# EAGLE design board (EAGLE 6.5.0)
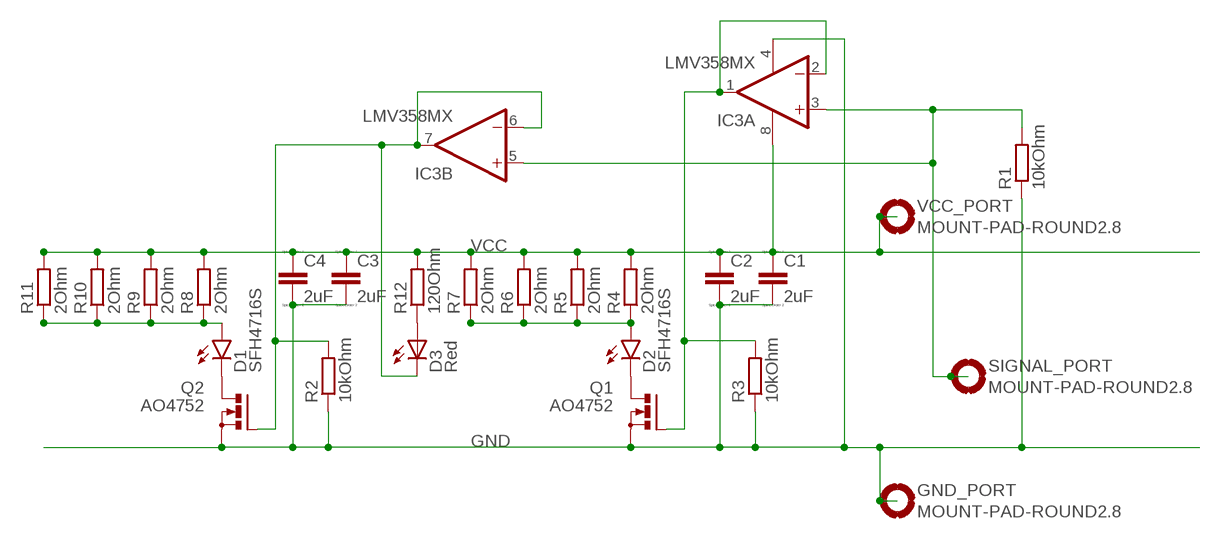
[diagram p0: schematic, sheet 1]

## Parts
C1  2uF  CC0603  [C0603]
C2  2uF  CC0603  [C0603]
C3  2uF  CC0603  [C0603]
C4  2uF  CC0603  [C0603]
D1  SFH4716S  SFH4641LARGE  [SFH4641]
D2  SFH4716S  SFH4641LARGE  [SFH4641]
D3  Red  LED5MM  [LED5MM]
GND_PORT  MOUNT-PAD-ROUND2.8  [2,8-PAD]
IC3  LMV358MX  [SO08]
Q1  AO4752  N-MOSFET-SO8S  [SO-08]
Q2  AO4752  N-MOSFET-SO8S  [SO-08]
R1  10kOhm  R-EU_R0603  [R0603]
R2  10kOhm  R-EU_R0603  [R0603]
R3  10kOhm  R-EU_R0603  [R0603]
R4  2Ohm  R-EU_R2512  [R2512]
R5  2Ohm  R-EU_R2512  [R2512]
R6  2Ohm  R-EU_R2512  [R2512]
R7  2Ohm  R-EU_R2512  [R2512]
R8  2Ohm  R-EU_R2512  [R2512]
R9  2Ohm  R-EU_R2512  [R2512]
R10  2Ohm  R-EU_R2512  [R2512]
R11  2Ohm  R-EU_R2512  [R2512]
R12  120Ohm  R-EU_R0603  [R0603]
SIGNAL_PORT  MOUNT-PAD-ROUND2.8  [2,8-PAD]
VCC_PORT  MOUNT-PAD-ROUND2.8  [2,8-PAD]

## Nets
F1: D2.C Q1.5(D) Q1.6(D) Q1.7(D) Q1.8(D)
F2: D1.C Q2.5(D) Q2.6(D) Q2.7(D) Q2.8(D)
GND: C1.2 C2.2 C3.2 C4.2 GND_PORT.B2,8(MOUNT) IC3.4(P:V-) Q1.1(S) Q1.2(S) Q1.3(S) Q2.1(S) Q2.2(S) Q2.3(S) R1.1 R2.1 R3.1
L1: D1.A R8.1 R9.1 R10.1 R11.1
L2: D2.A R4.1 R5.1 R6.1 R7.1
N$1: D3.A R12.1
N$4: D3.K(C) IC3.6(B:-IN) IC3.7(B:OUT) Q2.4(G) R2.2
N$5: IC3.3(A:+IN) IC3.5(B:+IN) R1.2 SIGNAL_PORT.B2,8(MOUNT)
N$8: IC3.1(A:OUT) IC3.2(A:-IN) Q1.4(G) R3.2
VCC: C1.1 C2.1 C3.1 C4.1 IC3.8(P:V+) R4.2 R5.2 R6.2 R7.2 R8.2 R9.2 R10.2 R11.2 R12.2 VCC_PORT.B2,8(MOUNT)

## Library data of the parts
C1-C4 = eagle-ltspice:C: CAPACITOR, European symbol; SPICEMODEL: NONE; SPICEPREFIX: C
D1 D2 = SparkFun-LED:SFH4641; PROD_ID: DIO-11994
D3 = led:LED: LED OSRAM: - CHIPLED LG R971, LG N971, LY N971, LG Q971, LY Q971, LO R971, LY R971 LH N974, LH R974 LS Q976, LO Q976, LY Q976 LO Q996 - Hyper CHIPLED LW Q18S LB Q993, LB Q99A, LB R99A - SideLED LS A670, LO A670, LY A670, LG A670, LP A670 LB A673, LV A673, LT A673, LW A673 LH A674 LY A675 LS A676, LA A676, LO A676, LY A676, LW A676 LS A679, LY A679, LG A679 - Hyper Micro SIDELED® LS Y876, LA Y876, LO Y876, LY Y876 LT Y87S - SmartLED LW L88C, LW L88S LB L89C, LB L89S, LG L890 LS L89K, LO L89K, LY L89K LS L896, LA L896, LO L896, LY L896 - TOPLED LS T670, LO T670, LY T670, LG T670, LP T670 LSG T670, LSP T670, LSY T670, LOP T670, LYG T670 LG T671, LOG T671, LSG T671 LB T673, LV T673, LT T673, LW T673 LH T674 LS T676, LA T676, LO T676, LY T676, LB T676, LH T676, LSB T676, LW T676 LB T67C, LV T67C, LT T67C, LS T67K, LO T67K, LY T67K, LW E67C LS E67B, LA E67B, LO E67B, LY E67B, LB E67C, LV E67C, LT E67C LW T67C LS T679, LY T679, LG T679 LS T770, LO T770, LY T770, LG T770, LP T770 LB T773, LV T773, LT T773, LW T773 LH T774 LS E675, LA E675, LY E675, LS T675 LS T776, LA T776, LO T776, LY T776, LB T776 LHGB T686 LT T68C, LB T68C - Hyper Mini TOPLED® LB M676 - Mini TOPLED Santana® LG M470 LS M47K, LO M47K, LY M47K Source: http://www.osram.convergy.de LUXEON: - LUMILED® LXK2-PW12-R00, LXK2-PW12-S00, LXK2-PW14-U00, LXK2-PW14-V00 LXK2-PM12-R00, LXK2-PM12-S00, LXK2-PM14-U00 LXK2-PE12-Q00, LXK2-PE12-R00, LXK2-PE12-S00, LXK2-PE14-T00, LXK2-PE14-U00 LXK2-PB12-K00, LXK2-PB12-L00, LXK2-PB12-M00, LXK2-PB14-N00, LXK2-PB14-P00, LXK2-PB14-Q00 LXK2-PR12-L00, LXK2-PR12-M00, LXK2-PR14-Q00, LXK2-PR14-R00 LXK2-PD12-Q00, LXK2-PD12-R00, LXK2-PD12-S00 LXK2-PH12-R00, LXK2-PH12-S00 LXK2-PL12-P00, LXK2-PL12-Q00, LXK2-PL12-R00 Source: www.luxeon.com KINGBRIGHT: KA-3528ASYC Source: www.kingbright.com
GND_PORT SIGNAL_PORT VCC_PORT = holes:MOUNT-PAD-ROUND: MOUNTING PAD, round
IC3 = linear:LMV358?*: Dual General Purpose, Low Voltage, Rail-to-Rail Output Operational Amplifiers Source: http://www.national.com/mpf/LM/LMV321.html http://www.national.com/dt/lmv_qual.pdf
Q1 Q2 = transistor-power:N-MOSFET-SO8: N-Channel MOSFET Example: FDS7760A; N-Channel Logic Level PowerTrench® MOSFET FDS2572; N-Channel UltraFET® Trench MOSFET Source: www.fairchildsemi.com
R1-R3 R12 = resistor:R-EU_: RESISTOR, European symbol
R4-R11 = rcl:R-EU_: RESISTOR, European symbol

## Net classes
0 default: clearance 0.205 mm

## Board
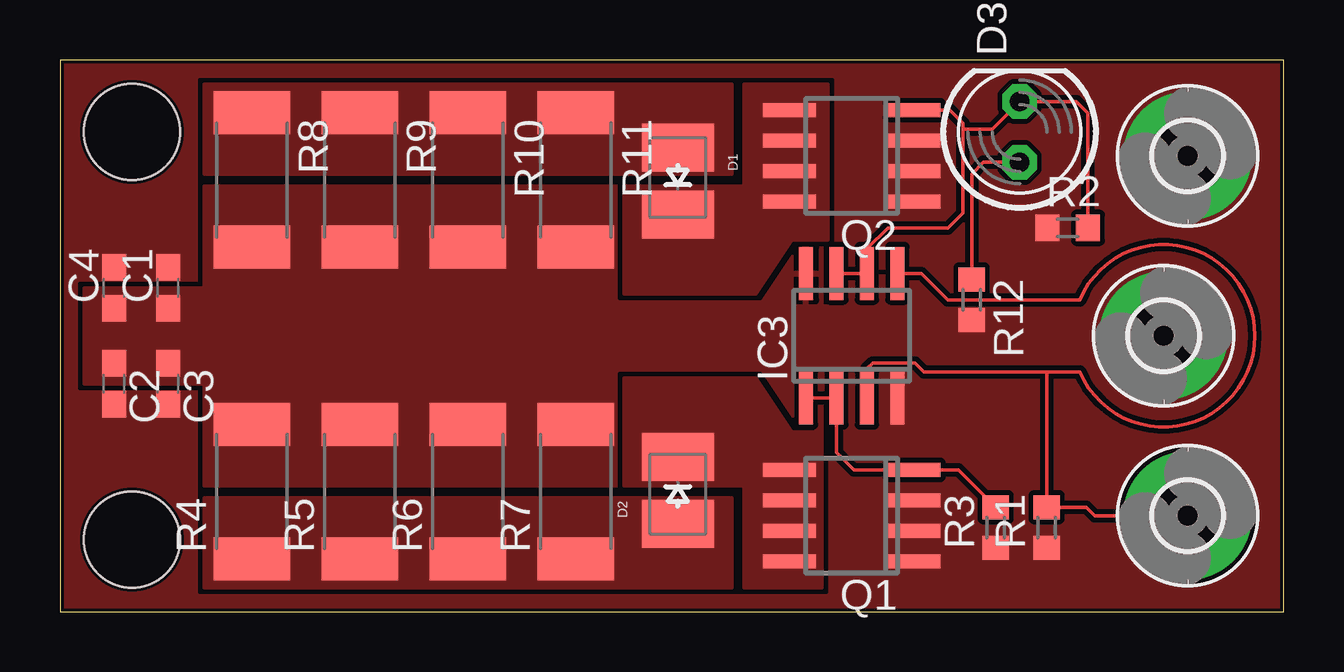
[diagram p1: board, top side]

Size 51 x 23 mm. Coordinates in mm from the lower left corner, seen from the top.
Outline: 0,0 51,0 51,23 0,23 0,0
Copper layers 1: Top 0.035mm
Design rules "SparkFun *": minimum track width 0.15mm, minimum drill 20mil, track to track 0.15mm, track to pad 0.15mm, pad to pad 0.15mm, via to via 0.15mm, smd to smd 0.15mm, copper to edge 0.15mm, drill to drill 0.15mm, minimum pad ring 12mil, minimum via ring 10mil, stop-mask expansion 4mil, vias tented up to drill 20mil, thermal gap 10mil
Holes 4 mm at 3,20 3,3

### Footprints (pad centres in the part's own frame; a part is rotated, then mirrored left to right if it is on the bottom)
C0603 = smd 1.1 x 1: 1 -0.85,0; 2 0.85,0
SFH4641 = smd 3 x 2: A 0,-1.6; C 0,1.2
LED5MM = drill 0.813 octagon: A -1.27,0; K 1.27,0
2,8-PAD = drill 2.8 pad 5.334: B2,8 0,0
SO08 = smd 0.6 x 2.2: 1 -1.905,-2.6; 2 -0.635,-2.6; 3 0.635,-2.6; 4 1.905,-2.6; 5 1.905,2.6; 6 0.635,2.6; 7 -0.635,2.6; 8 -1.905,2.6
SO-08 = smd 0.6 x 2.2: 1 -1.905,-2.6; 2 -0.635,-2.6; 3 0.635,-2.6; 4 1.905,-2.6; 5 1.905,2.6; 6 0.635,2.6; 7 -0.635,2.6; 8 -1.905,2.6
R0603 = smd 1 x 1.1: 1 -0.85,0; 2 0.85,0
R2512 = smd 1.8 x 3.2: 1 -2.8,0; 2 2.8,0

### Placement (x,y rotation side)
C1  4.5,13.5 90 top
C2  2.25,9.5 270 top
C3  4.5,9.5 270 top
C4  2.25,13.5 90 top
D1  25.75,17.75 180 top
D2  25.75,5.25 0 top
D3  40,20 90 top
GND_PORT  47,19 0 top
IC3  33,11.5 0 top
Q1  33,4 90 top
Q2  33,19 90 top
R1  41.12,3.5 90 top
R2  42,16 0 top
R3  39,3.5 90 top
R4  8,5 90 top
R5  12.5,5 90 top
R6  17,5 90 top
R7  21.5,5 90 top
R8  8,18 270 top
R9  12.5,18 270 top
R10  17,18 270 top
R11  21.5,18 270 top
R12  38,13 270 top
SIGNAL_PORT  47,4 0 top
VCC_PORT  46,11.5 0 top

### Tracks (layer width: path | path; a pad name or v marks a point on that pad's centre or on a via)
F1
  pour Top (no thermals): 23.5,5.25 28.5,5.25 28.5,1 31.75,1 31.75,8.62 31.5,8.62 31.5,7.5 30.5,7.5 29,9.75 23.5,9.75
F2
  pour Top (no thermals): 23.5,17.75 28.5,17.75 28.5,22 32,22 32,15.5 30.5,15.5 29,13.25 23.5,13.25
GND
  pour Top (isolate 0.15, rank 3, no thermals): 0,23 51,23 51,0 0,0
  pour Top (no thermals): 33.75,5.25 37.5,5.25 37.5,1 33.75,1
  pour Top (no thermals): 37,20.25 37,16.75 36.75,16.5 34.25,16.5 33.75,17 33.75,20 34,20.25
L1
  pour Top (no thermals): 6,18.25 28,18.25 28,22 6,22
L2
  pour Top (no thermals): 28,4.75 28,1 6,1 6,4.75
N$1
  Top 0.15: D3.A 38.48,18.73 38,18.25 R12.1
N$4
  Top 0.15: IC3.7 IC3.6 33.63,15.13 34.5,16 37,16 37.62,16.62 37.62,20.12 | 37.62,20.12 37.62,20.38 37.09,20.91 Q2.4 | R2.2 42.85,20.77 42.35,21.27 D3.K 38.85,20.12 37.62,20.12
N$5
  Top 0.15: IC3.5 35.9,14.1 37,13 42.5,13 arc-314 42.5,10 41.12,10 | 41.12,10 36,10 35.62,10.38 33.88,10.38 33.63,10.13 IC3.3 | SIGNAL_PORT.B2,8 43.12,4 42.77,4.35 R1.2 41.12,10
N$8
  Top 0.15: IC3.1 IC3.2 32.37,6.63 33.09,5.91 Q1.4 37.45,5.91 R3.2
VCC
  pour Top (rank 2, no thermals): 6,17.75 30.5,17.75 30.5,12.75 32.75,12.75 32.75,14 35.62,14 36.88,12.75 42.5,12.75 arc-321 42.5,10.25 31.88,10.25 31.88,9.12 31.5,9.12 31.5,10.25 30.75,10.25 30.75,5.25 6,5.25 6,9.5 1,9.5 1,13.5 6,13.5
  pour Top (rank 2): 31.75,15.25 30.25,15.25 30.25,12.75 31.75,12.75